# Altium schematic sheet P10 DDR4RAM.SchDoc
size 420 x 297 mm
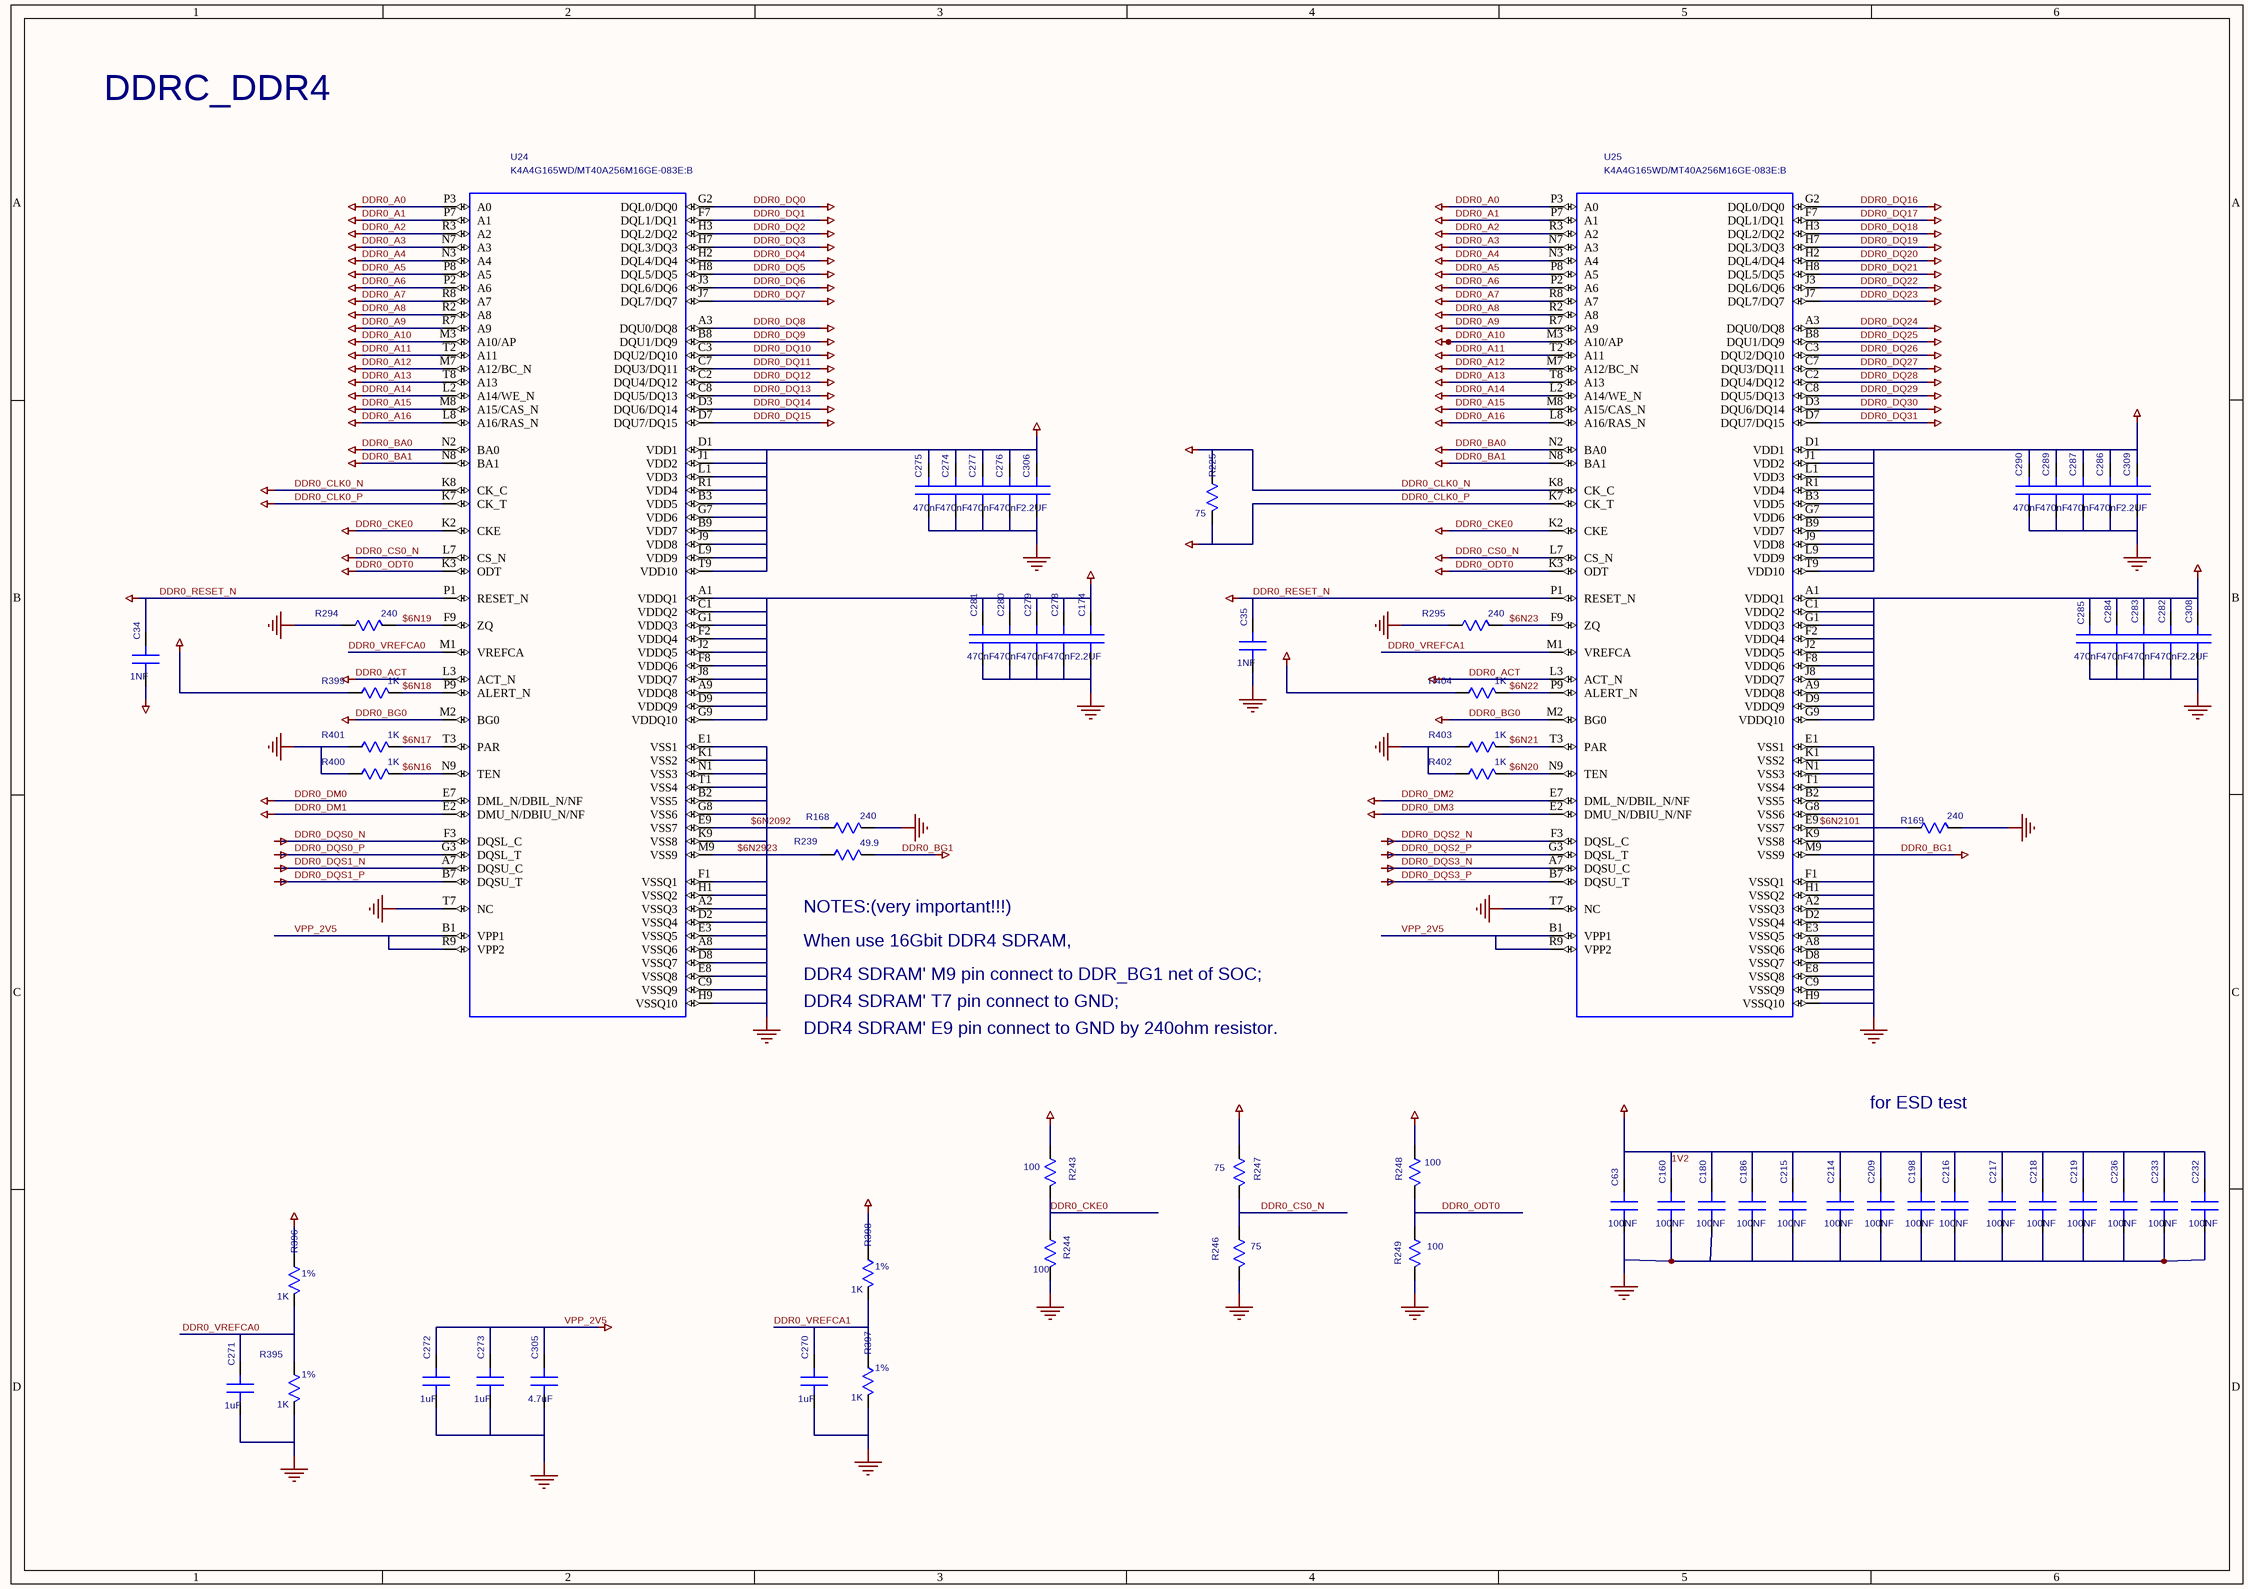
[diagram p0: P10 DDR4RAM.SchDoc]

## Parts
C34  1NF  [SC0402]
C35  1NF  [SC0402]
C63  100NF  [SC0402]
C160  100NF  [SC0402]
C174  2.2UF  [SC0402]
C180  100NF  [SC0402]
C186  100NF  [SC0402]
C198  100NF  [SC0402]
C209  100NF  [SC0402]
C214  100NF  [SC0402]
C215  100NF  [SC0402]
C216  100NF  [SC0402]
C217  100NF  [SC0402]
C218  100NF  [SC0402]
C219  100NF  [SC0402]
C232  100NF  [SC0402]
C233  100NF  [SC0402]
C236  100NF  [SC0402]
C270  1uF  [SC0402]
C271  1uF  [SC0402]
C272  1uF  [SC0402]
C273  1uF  [SC0402]
C274  470nF  [SC0402]
C275  470nF  [SC0402]
C276  470nF  [SC0402]
C277  470nF  [SC0402]
C278  470nF  [SC0402]
C279  470nF  [SC0402]
C280  470nF  [SC0402]
C281  470nF  [SC0402]
C282  470nF  [SC0402]
C283  470nF  [SC0402]
C284  470nF  [SC0402]
C285  470nF  [SC0402]
C286  470nF  [SC0402]
C287  470nF  [SC0402]
C289  470nF  [SC0402]
C290  470nF  [SC0402]
C305  4.7uF  [SC0402]
C306  2.2UF  [SC0402]
C308  2.2UF  [SC0402]
C309  2.2UF  [SC0402]
R168  240  [SR0402]
R169  240  [SR0402]
R225  75  [SR0402]
R239  49.9  [SR0402]
R243  100  [SR0402]
R244  100  [SR0402]
R246  75  [SR0402]
R247  75  [SR0402]
R248  100  [SR0402]
R249  100  [SR0402]
R294  240  [SR0402]
R295  240  [SR0402]
R395  1K  [SR0402]
R396  1K  [SR0402]
R397  1K  [SR0402]
R398  1K  [SR0402]
R399  1K  [SR0402]
R400  1K  [SR0402]
R401  1K  [SR0402]
R402  1K  [SR0402]
R403  1K  [SR0402]
R404  1K  [SR0402]
U24  K4A4G165WD/MT40A256M16GE-083E:B  [BGA96-32-1609N-BVT]
U25  K4A4G165WD/MT40A256M16GE-083E:B  [BGA96-32-1609N-BVT]

## Nets
1V2: C63.1(A) C160.1(A) C174.1(A) C180.1(A) C186.1(A) C198.1(A) C209.1(A) C214.1(A) C215.1(A) C216.1(A) C217.1(A) C218.1(A) C219.1(A) C232.1(A) C233.1(A) C236.1(A) C274.1(A) C275.1(A) C276.1(A) C277.1(A) C278.1(A) C279.1(A) C280.1(A) C281.1(A) C282.1(A) C283.1(A) C284.1(A) C285.1(A) C286.1(A) C287.1(A) C289.1(A) C290.1(A) C306.1(A) C308.1(A) C309.1(A) R243.1(A) R247.1(A) R248.1(A) R396.1(A) R398.1(A) R399.1(A) R404.1(A) U24.A1(VDDQ1) U24.A9(VDDQ8) U24.B3(VDD5) U24.B9(VDD7) U24.C1(VDDQ2) U24.D1(VDD1) U24.D9(VDDQ9) U24.F2(VDDQ4) U24.F8(VDDQ6) U24.G1(VDDQ3) U24.G7(VDD6) U24.G9(VDDQ10) U24.J1(VDD2) U24.J2(VDDQ5) U24.J8(VDDQ7) U24.J9(VDD8) U24.L1(VDD3) U24.L9(VDD9) U24.R1(VDD4) U24.T9(VDD10) U25.A1(VDDQ1) U25.A9(VDDQ8) U25.B3(VDD5) U25.B9(VDD7) U25.C1(VDDQ2) U25.D1(VDD1) U25.D9(VDDQ9) U25.F2(VDDQ4) U25.F8(VDDQ6) U25.G1(VDDQ3) U25.G7(VDD6) U25.G9(VDDQ10) U25.J1(VDD2) U25.J2(VDDQ5) U25.J8(VDDQ7) U25.J9(VDD8) U25.L1(VDD3) U25.L9(VDD9) U25.R1(VDD4) U25.T9(VDD10)
DDR0_A0: U24.P3(A0) U25.P3(A0)
DDR0_A1: U24.P7(A1) U25.P7(A1)
DDR0_A2: U24.R3(A2) U25.R3(A2)
DDR0_A3: U24.N7(A3) U25.N7(A3)
DDR0_A4: U24.N3(A4) U25.N3(A4)
DDR0_A5: U24.P8(A5) U25.P8(A5)
DDR0_A6: U24.P2(A6) U25.P2(A6)
DDR0_A7: U24.R8(A7) U25.R8(A7)
DDR0_A8: U24.R2(A8) U25.R2(A8)
DDR0_A9: U24.R7(A9) U25.R7(A9)
DDR0_A10: U24.M3(A10/AP) U25.M3(A10/AP)
DDR0_A11: U24.T2(A11) U25.T2(A11)
DDR0_A12: U24.M7(A12/BC_N) U25.M7(A12/BC_N)
DDR0_A13: U24.T8(A13) U25.T8(A13)
DDR0_A14: U24.L2(A14/WE_N) U25.L2(A14/WE_N)
DDR0_A15: U24.M8(A15/CAS_N) U25.M8(A15/CAS_N)
DDR0_A16: U24.L8(A16/RAS_N) U25.L8(A16/RAS_N)
DDR0_ACT: U24.L3(ACT_N) U25.L3(ACT_N)
DDR0_BA0: U24.N2(BA0) U25.N2(BA0)
DDR0_BA1: U24.N8(BA1) U25.N8(BA1)
DDR0_BG0: U24.M2(BG0) U25.M2(BG0)
DDR0_BG1: R239.2(B) U25.M9(VSS9)
DDR0_CKE0: R243.2(B) R244.1(A) U24.K2(CKE) U25.K2(CKE)
DDR0_CLK0_N: R225.1(A) U24.K8(CK_C) U25.K8(CK_C)  [also labelled DDR0_CLK_N]
DDR0_CLK0_P: R225.2(B) U24.K7(CK_T) U25.K7(CK_T)  [also labelled DDR0_CLK_P]
DDR0_CS0_N: R246.1(A) R247.2(B) U24.L7(CS_N) U25.L7(CS_N)
DDR0_DM0: U24.E7(DML_N/DBIL_N/NF)
DDR0_DM1: U24.E2(DMU_N/DBIU_N/NF)
DDR0_DM2: U25.E7(DML_N/DBIL_N/NF)
DDR0_DM3: U25.E2(DMU_N/DBIU_N/NF)
DDR0_DQ0: U24.G2(DQL0/DQ0)
DDR0_DQ1: U24.F7(DQL1/DQ1)
DDR0_DQ2: U24.H3(DQL2/DQ2)
DDR0_DQ3: U24.H7(DQL3/DQ3)
DDR0_DQ4: U24.H2(DQL4/DQ4)
DDR0_DQ5: U24.H8(DQL5/DQ5)
DDR0_DQ6: U24.J3(DQL6/DQ6)
DDR0_DQ7: U24.J7(DQL7/DQ7)
DDR0_DQ8: U24.A3(DQU0/DQ8)
DDR0_DQ9: U24.B8(DQU1/DQ9)
DDR0_DQ10: U24.C3(DQU2/DQ10)
DDR0_DQ11: U24.C7(DQU3/DQ11)
DDR0_DQ12: U24.C2(DQU4/DQ12)
DDR0_DQ13: U24.C8(DQU5/DQ13)
DDR0_DQ14: U24.D3(DQU6/DQ14)
DDR0_DQ15: U24.D7(DQU7/DQ15)
DDR0_DQ16: U25.G2(DQL0/DQ0)
DDR0_DQ17: U25.F7(DQL1/DQ1)
DDR0_DQ18: U25.H3(DQL2/DQ2)
DDR0_DQ19: U25.H7(DQL3/DQ3)
DDR0_DQ20: U25.H2(DQL4/DQ4)
DDR0_DQ21: U25.H8(DQL5/DQ5)
DDR0_DQ22: U25.J3(DQL6/DQ6)
DDR0_DQ23: U25.J7(DQL7/DQ7)
DDR0_DQ24: U25.A3(DQU0/DQ8)
DDR0_DQ25: U25.B8(DQU1/DQ9)
DDR0_DQ26: U25.C3(DQU2/DQ10)
DDR0_DQ27: U25.C7(DQU3/DQ11)
DDR0_DQ28: U25.C2(DQU4/DQ12)
DDR0_DQ29: U25.C8(DQU5/DQ13)
DDR0_DQ30: U25.D3(DQU6/DQ14)
DDR0_DQ31: U25.D7(DQU7/DQ15)
DDR0_DQS0_N: U24.F3(DQSL_C)
DDR0_DQS0_P: U24.G3(DQSL_T)
DDR0_DQS1_N: U24.A7(DQSU_C)
DDR0_DQS1_P: U24.B7(DQSU_T)
DDR0_DQS2_N: U25.F3(DQSL_C)
DDR0_DQS2_P: U25.G3(DQSL_T)
DDR0_DQS3_N: U25.A7(DQSU_C)
DDR0_DQS3_P: U25.B7(DQSU_T)
DDR0_ODT0: R248.2(B) R249.1(A) U24.K3(ODT) U25.K3(ODT)
DDR0_RESET_N: C34.1(A) C35.1(A) U24.P1(RESET_N) U25.P1(RESET_N)
GND: C34.2(B) C35.2(B) C63.2(B) C160.2(B) C174.2(B) C180.2(B) C186.2(B) C198.2(B) C209.2(B) C214.2(B) C215.2(B) C216.2(B) C217.2(B) C218.2(B) C219.2(B) C232.2(B) C233.2(B) C236.2(B) C270.2(B) C271.2(B) C272.2(B) C273.2(B) C274.2(B) C275.2(B) C276.2(B) C277.2(B) C278.2(B) C279.2(B) C280.2(B) C281.2(B) C282.2(B) C283.2(B) C284.2(B) C285.2(B) C286.2(B) C287.2(B) C289.2(B) C290.2(B) C305.2(B) C306.2(B) C308.2(B) C309.2(B) R168.2(B) R169.2(B) R244.2(B) R246.2(B) R249.2(B) R294.1(A) R295.1(A) R395.2(B) R397.2(B) R400.1(A) R401.1(A) R402.1(A) R403.1(A) U24.A2(VSSQ3) U24.A8(VSSQ6) U24.B2(VSS5) U24.C9(VSSQ9) U24.D2(VSSQ4) U24.D8(VSSQ7) U24.E1(VSS1) U24.E3(VSSQ5) U24.E8(VSSQ8) U24.F1(VSSQ1) U24.G8(VSS6) U24.H1(VSSQ2) U24.H9(VSSQ10) U24.K1(VSS2) U24.K9(VSS8) U24.N1(VSS3) U24.T1(VSS4) U24.T7(NC) U25.A2(VSSQ3) U25.A8(VSSQ6) U25.B2(VSS5) U25.C9(VSSQ9) U25.D2(VSSQ4) U25.D8(VSSQ7) U25.E1(VSS1) U25.E3(VSSQ5) U25.E8(VSSQ8) U25.F1(VSSQ1) U25.G8(VSS6) U25.H1(VSSQ2) U25.H9(VSSQ10) U25.K1(VSS2) U25.K9(VSS8) U25.N1(VSS3) U25.T1(VSS4) U25.T7(NC)
VPP_2V5: C272.1(A) C273.1(A) C305.1(A) U24.B1(VPP1) U24.R9(VPP2) U25.B1(VPP1) U25.R9(VPP2)
$6N16: R400.2(B) U24.N9(TEN)
$6N17: R401.2(B) U24.T3(PAR)
$6N18: R399.2(B) U24.P9(ALERT_N)
$6N19: R294.2(B) U24.F9(ZQ)
$6N20: R402.2(B) U25.N9(TEN)
$6N21: R403.2(B) U25.T3(PAR)
$6N22: R404.2(B) U25.P9(ALERT_N)
$6N23: R295.2(B) U25.F9(ZQ)
$6N2092: R168.1(A) U24.E9(VSS7)
$6N2101: R169.1(A) U25.E9(VSS7)
$6N2923: R239.1(A) U24.M9(VSS9)
DDR0_VREFCA0: C271.1(A) R395.1(A) R396.2(B) U24.M1(VREFCA)
DDR0_VREFCA1: C270.1(A) R397.1(A) R398.2(B) U25.M1(VREFCA)

## Notes on the sheet
- DDRC_DDR4
- (near R239) NOTES:(very important!!!)
- DDR4 SDRAM' M9 pin connect to DDR_BG1 net of SOC;
- When use 16Gbit DDR4 SDRAM,
- DDR4 SDRAM' E9 pin connect to GND by 240ohm resistor.
- DDR4 SDRAM' T7 pin connect to GND;
- for ESD test
- (near R398) 1%
- (near R396) 1%
- (near R395) 1%
- (near R397) 1%

## Library data of the parts
C34 C35 = C: PARTS: 1; OriginalSymbolOrigin: (0,0); DEVICE: C0402C102J5GAC7867; LEVEL: STD; PINSWAP: (A,B); %208%%161%%192%%224%%195%%251%%179%%198%: SMD陶瓷电容; %195%%232%%202%%246%: SMD陶瓷电容-50V-1nF-+/-5%-NP0-0402; CODE: 8070846; %182%%238%%182%%168%%185%%164%%215%%247%%181%%231%%209%%185%(V): 50; COMPONENT_HIGH_MAX: 0.55mm; PKG_TYPE: SC0402
C63 C160 C186 C209 C215 C217 C219 C233 = C: PARTS: 1; OriginalSymbolOrigin: (0,0); DEVICE: RMEMK105BJ104KV_FR; LEVEL: STD; PINSWAP: (A,B); %208%%161%%192%%224%%195%%251%%179%%198%: SMD陶瓷电容; COMPONENT_HIGH_MAX: 0.55MM; %182%%238%%182%%168%%185%%164%%215%%247%%181%%231%%209%%185%(V): 16; %195%%232%%202%%246%: SMD陶瓷电容-16V-100nF-+/-10%-X7R-0402-BT; CODE: 8070614; PKG_TYPE: SC0402
C174 C309 = C: PARTS: 1; OriginalSymbolOrigin: (0,0); DEVICE: GRM155C70J225KE11D; LEVEL: STD; PINSWAP: (A,B); %208%%161%%192%%224%%195%%251%%179%%198%: SMD陶瓷电容; COMPONENT_HIGH_MAX: 0.7MM; %182%%238%%182%%168%%185%%164%%215%%247%%181%%231%%209%%185%(V): 6.3; %195%%232%%202%%246%: SMD陶瓷电容-6.3V-2200nF-+/-10%-X7S-0402; CODE: 8071990; PKG_TYPE: SC0402
C180 C198 C214 C216 C218 C232 C236 = C: PARTS: 1; OriginalSymbolOrigin: (0,0); DEVICE: RMEMK105BJ104KV_FR; LEVEL: STD; PINSWAP: (A,B); CODE: 8070614; %195%%232%%202%%246%: SMD陶瓷电容-16V-100nF-+/-10%-X7R-0402-BT; %182%%238%%182%%168%%185%%164%%215%%247%%181%%231%%209%%185%(V): 16; COMPONENT_HIGH_MAX: 0.55MM; %208%%161%%192%%224%%195%%251%%179%%198%: SMD陶瓷电容; PKG_TYPE: SC0402
C270-C273 = C: PARTS: 1; OriginalSymbolOrigin: (0,0); DEVICE: C1005X6S1A105KT000F; LEVEL: STD; PINSWAP: (A,B); %208%%161%%192%%224%%195%%251%%179%%198%: SMD陶瓷电容; %195%%232%%202%%246%: SMD陶瓷电容-10V-1000nF-+/-10%-X6S-0402; CODE: 8071747; COMPONENT_HIGH_MAX: 0.6mm; %182%%238%%182%%168%%185%%164%%215%%247%%181%%231%%209%%185%(V): 10; PKG_TYPE: SC0402
C274-C277 = C: PARTS: 1; OriginalSymbolOrigin: (0,0); DEVICE: GRM155R71A474KE01D; LEVEL: STD; PINSWAP: (A,B); COMPONENT_HIGH_MAX: -999999mm; %182%%238%%182%%168%%185%%164%%215%%247%%181%%231%%209%%185%(V): 6.3; CODE: 8072110; %195%%232%%202%%246%: SMD陶瓷电容-6.3V-470nF-+/-10%-X7R-0402; %208%%161%%192%%224%%195%%251%%179%%198%: SMD陶瓷电容; PKG_TYPE: SC0402
C278-C281 = C: PARTS: 1; OriginalSymbolOrigin: (0,0); DEVICE: GRM155R71A474KE01D; LEVEL: STD; PINSWAP: (A,B); %208%%161%%192%%224%%195%%251%%179%%198%: SMD陶瓷电容; %195%%232%%202%%246%: SMD陶瓷电容-6.3V-470nF-+/-10%-X7R-0402; CODE: 8072110; %182%%238%%182%%168%%185%%164%%215%%247%%181%%231%%209%%185%(V): 6.3; COMPONENT_HIGH_MAX: -999999mm; PKG_TYPE: SC0402
C282-C284 C286 C287 C289 = C: PARTS: 1; OriginalSymbolOrigin: (0,0); DEVICE: GRM155R71A474KE01D; LEVEL: STD; PINSWAP: (A,B); %182%%238%%182%%168%%185%%164%%215%%247%%181%%231%%209%%185%(V): 6.3; COMPONENT_HIGH_MAX: -999999mm; CODE: 8072110; %195%%232%%202%%246%: SMD陶瓷电容-6.3V-470nF-+/-10%-X7R-0402; %208%%161%%192%%224%%195%%251%%179%%198%: SMD陶瓷电容; PKG_TYPE: SC0402
C285 C290 = C: PARTS: 1; OriginalSymbolOrigin: (0,0); DEVICE: GRM155R71A474KE01D; LEVEL: STD; PINSWAP: (A,B); %208%%161%%192%%224%%195%%251%%179%%198%: SMD陶瓷电容; %195%%232%%202%%246%: SMD陶瓷电容-6.3V-470nF-+/-10%-X7R-0402; CODE: 8072110; COMPONENT_HIGH_MAX: -999999mm; %182%%238%%182%%168%%185%%164%%215%%247%%181%%231%%209%%185%(V): 6.3; PKG_TYPE: SC0402
C305 = C: PARTS: 1; OriginalSymbolOrigin: (0,0); DEVICE: CM05X6T475M06AH-HW; LEVEL: STD; PINSWAP: (A,B); %208%%161%%192%%224%%195%%251%%179%%198%: SMD陶瓷电容; %195%%232%%202%%246%: SMD陶瓷电容-6.3V-4700nF-+/-20%-X6T-0402-华技终端专用; CODE: 8072081; %182%%238%%182%%168%%185%%164%%215%%247%%181%%231%%209%%185%(V): 6.3; COMPONENT_HIGH_MAX: -999999mm; PKG_TYPE: SC0402
C306 C308 = C: PARTS: 1; OriginalSymbolOrigin: (0,0); DEVICE: GRM155C70J225KE11D; LEVEL: STD; PINSWAP: (A,B); CODE: 8071990; %195%%232%%202%%246%: SMD陶瓷电容-6.3V-2200nF-+/-10%-X7S-0402; %182%%238%%182%%168%%185%%164%%215%%247%%181%%231%%209%%185%(V): 6.3; COMPONENT_HIGH_MAX: 0.7MM; %208%%161%%192%%224%%195%%251%%179%%198%: SMD陶瓷电容; PKG_TYPE: SC0402
R168 R169 = R_Dup1: PARTS: 1; OriginalSymbolOrigin: (0,0); PINSWAP: (A,B); DEVICE: RC0402FR_07240RL; LEVEL: STD; %182%%238%%182%%168%%185%%166%%194%%202%(W): 0.06; %215%%232%%214%%181%%212%%202%%208%%237%%198%%171%%178%%238%: +/- 1%; COMPONENT_HIGH_MAX: 0.4mm; CODE: 7091782; %195%%232%%202%%246%: 片式厚膜电阻器-0.0625W-240ohm-+/- 1%-0402-BT; %208%%161%%192%%224%%195%%251%%179%%198%: 片式厚膜电阻器; PKG_TYPE: SR0402
R225 = R_Dup1: PARTS: 1; OriginalSymbolOrigin: (0,0); PINSWAP: (A,B); DEVICE: RC_02W750FT; LEVEL: STD; %208%%161%%192%%224%%195%%251%%179%%198%: 片式厚膜电阻器; COMPONENT_HIGH_MAX: 0.4MM; %195%%232%%202%%246%: 片式厚膜电阻器-0.0625W-75ohm-+/-1%-0402; CODE: 7091321; PKG_TYPE: SR0402
R239 = R_Dup1: PARTS: 1; OriginalSymbolOrigin: (0,0); PINSWAP: (A,B); DEVICE: RK73H1ETTP49R9F; LEVEL: STD; CODE: 7090776; %195%%232%%202%%246%: 片式厚膜电阻器-0.0625W-49.9ohm-+/-1%-0402-BT; %182%%238%%182%%168%%185%%166%%194%%202%(W): 0.06; %215%%232%%214%%181%%212%%202%%208%%237%%198%%171%%178%%238%: +/-1%; COMPONENT_HIGH_MAX: 0.4mm; %208%%161%%192%%224%%195%%251%%179%%198%: 片式厚膜电阻器; PKG_TYPE: SR0402
R243 = R_Dup1: PARTS: 1; OriginalSymbolOrigin: (0,0); PINSWAP: (A,B); DEVICE: RC0402JR_07100R; LEVEL: STD; %208%%161%%192%%224%%195%%251%%179%%198%: 片式厚膜电阻器; COMPONENT_HIGH_MAX: 0.4MM; %215%%232%%214%%181%%212%%202%%208%%237%%198%%171%%178%%238%: +/-5%; %182%%238%%182%%168%%185%%166%%194%%202%(W): 0.06; %195%%232%%202%%246%: 片式厚膜电阻器-0.0625W-100ohm-+/-5%-0402-BT; CODE: 7090807; PKG_TYPE: SR0402
R244 R248 R249 = R_Dup1: PARTS: 1; OriginalSymbolOrigin: (0,0); PINSWAP: (A,B); DEVICE: RC0402JR_07100R; LEVEL: STD; CODE: 7090807; %195%%232%%202%%246%: 片式厚膜电阻器-0.0625W-100ohm-+/-5%-0402-BT; %182%%238%%182%%168%%185%%166%%194%%202%(W): 0.06; %215%%232%%214%%181%%212%%202%%208%%237%%198%%171%%178%%238%: +/-5%; COMPONENT_HIGH_MAX: 0.4MM; %208%%161%%192%%224%%195%%251%%179%%198%: 片式厚膜电阻器; PKG_TYPE: SR0402
R246 = R_Dup1: PARTS: 1; OriginalSymbolOrigin: (0,0); PINSWAP: (A,B); DEVICE: RC0402JR_07100R; LEVEL: STD; %208%%161%%192%%224%%195%%251%%179%%198%: 片式厚膜电阻器; COMPONENT_HIGH_MAX: 0.4MM; %215%%232%%214%%181%%212%%202%%208%%237%%198%%171%%178%%238%: +/-5%; %182%%238%%182%%168%%185%%166%%194%%202%(W): 0.06; %195%%232%%202%%246%: 片式厚膜电阻器-0.0625W-75ohm-+/-1%-0402; CODE: 7091321; PKG_TYPE: SR0402
R247 = R_Dup1: PARTS: 1; OriginalSymbolOrigin: (0,0); PINSWAP: (A,B); DEVICE: RC0402JR_07100R; LEVEL: STD; CODE: 7091321; %195%%232%%202%%246%: 片式厚膜电阻器-0.0625W-75ohm-+/-1%-0402; %182%%238%%182%%168%%185%%166%%194%%202%(W): 0.06; %215%%232%%214%%181%%212%%202%%208%%237%%198%%171%%178%%238%: +/-5%; COMPONENT_HIGH_MAX: 0.4MM; %208%%161%%192%%224%%195%%251%%179%%198%: 片式厚膜电阻器; PKG_TYPE: SR0402
R294 R295 = R_Dup1: PARTS: 1; OriginalSymbolOrigin: (0,0); PINSWAP: (A,B); DEVICE: RC0402FR_07240RL; LEVEL: STD; %182%%238%%182%%168%%185%%166%%194%%202%(W): 0.06; %215%%232%%214%%181%%212%%202%%208%%237%%198%%171%%178%%238%: +/- 1%; COMPONENT_HIGH_MAX: 0.4MM; CODE: 7091782; %195%%232%%202%%246%: 片式厚膜电阻器-0.0625W-240OHM-+/- 1%-0402-BT; %208%%161%%192%%224%%195%%251%%179%%198%: 片式厚膜电阻器; PKG_TYPE: SR0402
R395-R398 = R_Dup1: PARTS: 1; OriginalSymbolOrigin: (0,0); PINSWAP: (A,B); DEVICE: RC0402FR_071KL; LEVEL: STD; %215%%232%%214%%181%%212%%202%%208%%237%%198%%171%%178%%238%: +/-1%; %182%%238%%182%%168%%185%%166%%194%%202%(W): 0.06; %208%%161%%192%%224%%195%%251%%179%%198%: 片式厚膜电阻器; %195%%232%%202%%246%: 片式厚膜电阻器-0.0625W-1000ohm-+/-1%-0402-BT; CODE: 7091282; COMPONENT_HIGH_MAX: 0.4mm; PKG_TYPE: SR0402
R399-R404 = R_Dup1: PARTS: 1; OriginalSymbolOrigin: (0,0); PINSWAP: (A,B); DEVICE: RC0402FR_071KL; LEVEL: STD; %208%%161%%192%%224%%195%%251%%179%%198%: 片式厚膜电阻器; %195%%232%%202%%246%: 片式厚膜电阻器-0.0625W-1000ohm-+/-1%-0402-BT; CODE: 7091282; COMPONENT_HIGH_MAX: 0.4mm; %215%%232%%214%%181%%212%%202%%208%%237%%198%%171%%178%%238%: +/-1%; %182%%238%%182%%168%%185%%166%%194%%202%(W): 0.06; PKG_TYPE: SR0402
U24 U25 = K4A4G165WD: PARTS: 1; OriginalSymbolOrigin: (0,0); LEVEL: STD; DEVICE: MT40A1G16KNR-075E; %208%%161%%192%%224%%195%%251%%179%%198%: DDR4 DRAM; %195%%232%%202%%246%: DDR4 DRAM-16Gbit-1333MHz-16bit-1.2V-FBGA96-02352070; CODE: HBVT3164; PKG_TYPE: BGA96-32-1609N-BVT